# Altium schematic sheet SelfDrivingCar_SCH_STM32F103C8T6.SchDoc
size A; DocumentNumber: 5; SheetNumber: 4; SheetTotal: 7
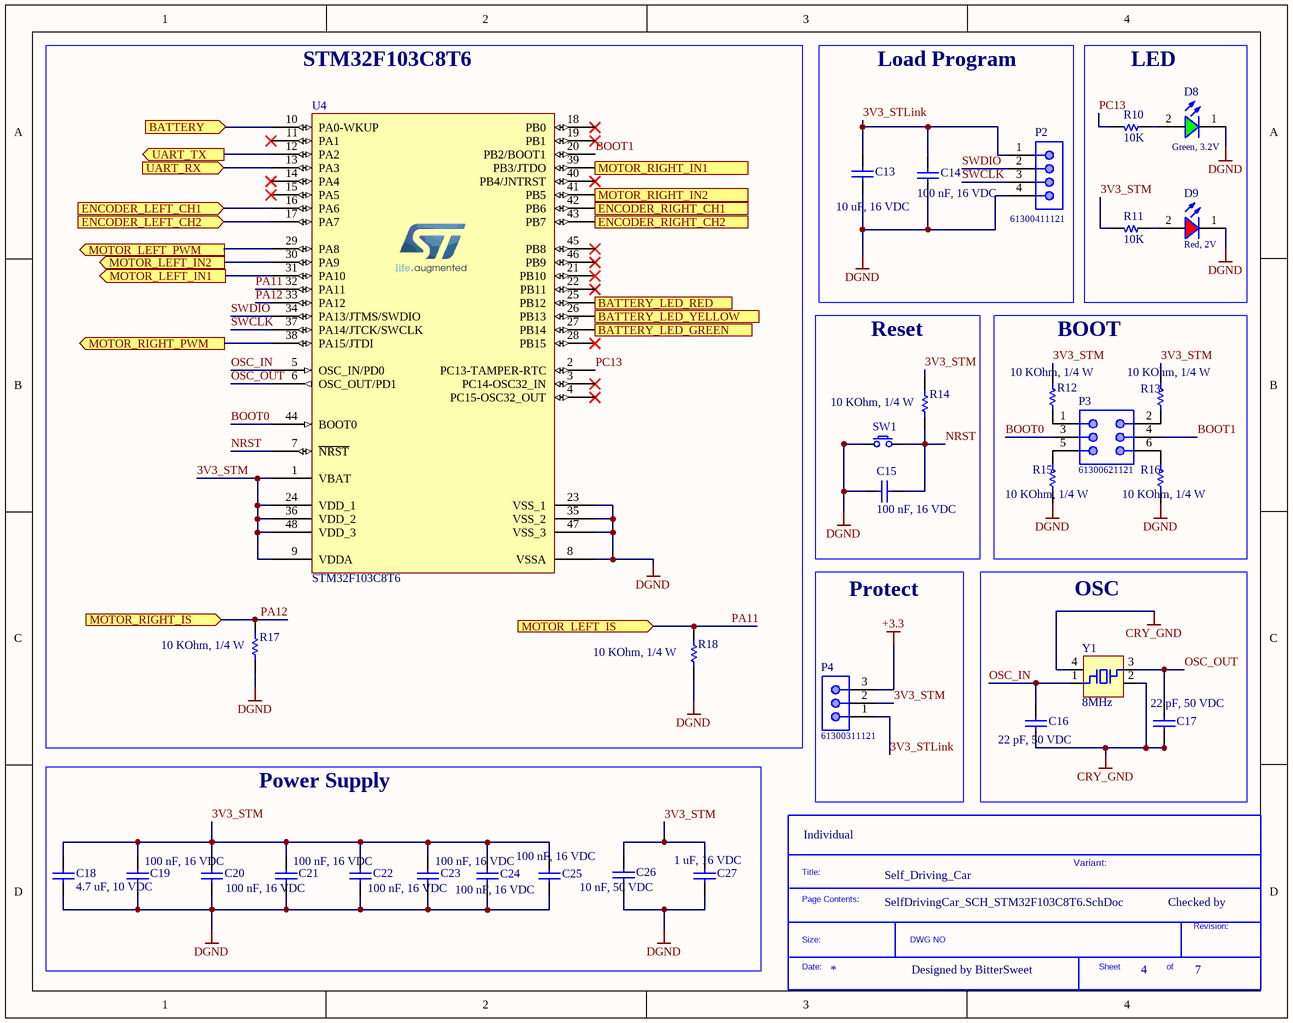
[diagram p0: SelfDrivingCar_SCH_STM32F103C8T6.SchDoc]

## Parts
*?  SDTitleBlock  (value not drawn)  (graphical)
C13  10 uF, 16 VDC  [CAP_0603]
C14  100 nF, 16 VDC  [CAP_0603]
C15  100 nF, 16 VDC  [CAP_0603]
C16  22 pF, 50 VDC  [CAP_0603]
C17  22 pF, 50 VDC  [CAP_0603]
C18  4.7 uF, 10 VDC  [CAP_0603]
C19  100 nF, 16 VDC  [CAP_0603]
C20  100 nF, 16 VDC  [CAP_0603]
C21  100 nF, 16 VDC  [CAP_0603]
C22  100 nF, 16 VDC  [CAP_0603]
C23  100 nF, 16 VDC  [CAP_0603]
C24  100 nF, 16 VDC  [CAP_0603]
C25  100 nF, 16 VDC  [CAP_0603]
C26  10 nF, 50 VDC  [CAP_0603]
C27  1 uF, 16 VDC  [CAP_0603]
D8  Green, 3.2V  [WL-SMCW_0603_H=0.7mm]
D9  Red, 2V  [WL-SMCW_0603_H=0.7mm]
P2  61300411121  [61300411121]
P3  61300621121  [61300621121]
P4  61300311121  [61300311121]
R10  10K  [R 0603]
R11  10K  [R 0603]
R12  10 KOhm, 1/4 W  [resistor_0603]
R13  10 KOhm, 1/4 W  [resistor_0603]
R14  10 KOhm, 1/4 W  [resistor_0603]
R15  10 KOhm, 1/4 W  [resistor_0603]
R16  10 KOhm, 1/4 W  [resistor_0603]
R17  10 KOhm, 1/4 W  [resistor_0603]
R18  10 KOhm, 1/4 W  [resistor_0603]
SW1  ?  [Button]  (value not drawn)
U4  STM32F103C8T6  [STM32F103C8T6]
Y1  8MHz  [Crystal SMD 4PIN 32x25]

## Blocks framed on the sheet
STM32F103C8T6: R17 R18 U4
Load Program: C13 C14 P2
LED: D8 D9 R10 R11
Reset: C15 R14 SW1
BOOT: P3 R12 R13 R15 R16
Protect: P4
OSC: C16 C17 Y1
Power Supply: C18-C27

## Ports
BATTERY (in), BATTERY_LED_GREEN (out), BATTERY_LED_RED (out), BATTERY_LED_YELLOW (out), ENCODER_LEFT_CH1 (in), ENCODER_LEFT_CH2 (in), ENCODER_RIGHT_CH1 (in), ENCODER_RIGHT_CH2 (in), MOTOR_LEFT_IN1 (out), MOTOR_LEFT_IN2 (out), MOTOR_LEFT_IS (in), MOTOR_LEFT_PWM (out), MOTOR_RIGHT_IN1 (out), MOTOR_RIGHT_IN2 (out), MOTOR_RIGHT_IS (in), MOTOR_RIGHT_PWM (out), UART_RX (in), UART_TX (out)

## Nets
+3.3: P4.3
CRY_GND: C16.1 C17.1 Y1.2(GND) Y1.4(GND)
DGND: C13.1 C14.1 C15.1 C18.1 C19.1 C20.1 C21.1 C22.1 C23.1 C24.1 C25.1 C26.1 C27.1 D8.1(K) D9.1(K) P2.4 R15.1 R16.1 R17.2 R18.1 SW1.1 U4.8(VSSA) U4.23(VSS_1) U4.35(VSS_2) U4.47(VSS_3)
3V3_STLink: C13.2 C14.2 P2.1 P4.1
3V3_STM: C18.2 C19.2 C20.2 C21.2 C22.2 C23.2 C24.2 C25.2 C26.2 C27.2 P4.2 R11.2 R12.2 R13.2 R14.2 U4.1(VBAT) U4.9(VDDA) U4.24(VDD_1) U4.36(VDD_2) U4.48(VDD_3)
BATTERY: U4.10(PA0-WKUP) ; port BATTERY
BATTERY_LED_GREEN: U4.27(PB14) ; port BATTERY_LED_GREEN
BATTERY_LED_RED: U4.25(PB12) ; port BATTERY_LED_RED
BATTERY_LED_YELLOW: U4.26(PB13) ; port BATTERY_LED_YELLOW
BOOT0: P3.3 U4.44(BOOT0)
BOOT1: P3.4 U4.20(PB2/BOOT1)
ENCODER_LEFT_CH1: U4.16(PA6) ; port ENCODER_LEFT_CH1
ENCODER_LEFT_CH2: U4.17(PA7) ; port ENCODER_LEFT_CH2
ENCODER_RIGHT_CH1: U4.42(PB6) ; port ENCODER_RIGHT_CH1
ENCODER_RIGHT_CH2: U4.43(PB7) ; port ENCODER_RIGHT_CH2
MOTOR_LEFT_IN1: U4.31(PA10) ; port MOTOR_LEFT_IN1
MOTOR_LEFT_IN2: U4.30(PA9) ; port MOTOR_LEFT_IN2
MOTOR_LEFT_PWM: U4.29(PA8) ; port MOTOR_LEFT_PWM
MOTOR_RIGHT_IN1: U4.39(PB3/JTDO) ; port MOTOR_RIGHT_IN1
MOTOR_RIGHT_IN2: U4.41(PB5) ; port MOTOR_RIGHT_IN2
MOTOR_RIGHT_PWM: U4.38(PA15/JTDI) ; port MOTOR_RIGHT_PWM
NRST: C15.2 R14.1 SW1.2 U4.7(~{NRST})
OSC_IN: C16.2 U4.5(OSC_IN/PD0) Y1.1(XTAL)
OSC_OUT: C17.2 U4.6(OSC_OUT/PD1) Y1.3(XTAL)
PA11: R18.2 U4.32(PA11) ; port MOTOR_LEFT_IS
PA12: R17.1 U4.33(PA12) ; port MOTOR_RIGHT_IS
PC13: R10.2 U4.2(PC13-TAMPER-RTC)
SWCLK: P2.3 U4.37(PA14/JTCK/SWCLK)
SWDIO: P2.2 U4.34(PA13/JTMS/SWDIO)
UART_RX: U4.13(PA3) ; port UART_RX
UART_TX: U4.12(PA2) ; port UART_TX
NetD8_2: D8.2(A) R10.1
NetD9_2: D9.2(A) R11.1
NetP3_1: P3.1 R12.1
NetP3_2: P3.2 R13.1
NetP3_5: P3.5 R15.2
NetP3_6: P3.6 R16.2

Not connected (* = marked no-connect by the designer): U4 3(PC14-OSC32_IN)* 4(PC15-OSC32_OUT)* 11(PA1)* 14(PA4)* 15(PA5)* 18(PB0)* 19(PB1)* 21(PB10)* 22(PB11)* 28(PB15)* 40(PB4/JNTRST)* 45(PB8)* 46(PB9)*

## Notes on the sheet
- (near *?) Individual
- Self_Driving_Car
- Variant:
- Checked by
- Designed by BitterSweet
- (in symbol SDTitleBlock) Title:; Page Contents:; Revision:; Size:; DWG NO; Date:; Sheet; of

## Library data of the parts
C13 = 0106031061010: CAP, size 0603, 10 uF, 16 VDC; Manufacture Name: Samsung Electro-Mechanics; Manufacture SN: CL10A106KP8NNWC; Capacitance: 10 uF; Tolerance: +/-10%; Voltage Rating DC: 16 VDC; ComponentLink2Description: Datasheet; ComponentLink2URL: https://www.mouser.vn/datasheet/2/585/MLCC-1837944.pdf; Operating Temperature: -55 to +125degC; Packaging: Tape and Reel; Mounting Technology: SMT; Size: 0603; Supplier 1 Name: Mouser; Supplier 1 SN: 187-CL10A106KP8NNWC; Supplier 1 URL: https://www.mouser.vn/ProductDetail/Samsung-Electro-Mechanics/CL10A106KP8NNWC?qs=xZ%2FP%252Ba9zWqZx8LSX23YqWA%3D%3D&utm_source=mouser-refine-download&utm_medium=file&utm_campaign=CL10A106KP8NNWC&utm_content=Samsung-Electro-Mechanics; Supplier 2 Name: Digi-Key; Supplier 2 SN: 1276-CL10A106KP8NNWCTR-ND; Supplier 2 URL: https://www.digikey.com/en/products/detail/samsung-electro-mechanics/cl10a106kp8nnwc/16572907; Supplier 3 Name: thegioiic; Supplier 3 SN: N/A; Supplier 3 URL: https://www.thegioiic.com/tu-gom-0603-10uf-16v; Value: 10 uF, 16 VDC; SUPPLIER NAME: JLCPCB; SUPPLIER SN: C703132; SUPPLIER URL: https://jlcpcb.com/partdetail/738561-GRM188R61C106MAALD/C703132
C14 C15 C19-C25 = 0106031041050: CAP, size 0603, 100 nF, 16 VDC; Manufacture Name: TDK; Manufacture SN: CGA3E3X8R1H104K080AE; Capacitance: 100 nF; Tolerance: +/-10%; Voltage Rating DC: 16 VDC; ComponentLink2Description: Datasheet; ComponentLink2URL: https://product.tdk.com/system/files/dam/doc/product/capacitor/ceramic/mlcc/catalog/mlcc_automotive_soft_en.pdf?ref_disty=mouser; Operating Temperature: -55 to +125degC; Packaging: Tape and Reel; Mounting Technology: SMT; Size: 0603; Supplier 1 Name: Mouser; Supplier 1 SN: 810-CGA3E3X8R1H104KA; Supplier 1 URL: https://www.mouser.com/ProductDetail/TDK/CGA3E3X8R1H104K080AE?qs=nQSIdc08i%252Bd8g3IRRgU2bw%3D%3D&utm_source=mouser-refine-download&utm_medium=file&utm_campaign=CGA3E3X8R1H104K080AE&utm_content=TDK; Supplier 2 Name: Digi-Key; Supplier 2 SN: 445-173697-2-ND; Supplier 2 URL: https://www.digikey.com/en/products/detail/tdk-corporation/cga3e3x8r1h104k080ae/5809262; Supplier 3 Name: thegioiic; Supplier 3 SN: N/A; Supplier 3 URL: https://www.thegioiic.com/tu-gom-0603-100nf-0-1uf-16v; Value: 100 nF, 16 VDC; SUPPLIER NAME: JLCPCB; SUPPLIER SN: C525499; SUPPLIER URL: https://jlcpcb.com/partdetail/Walsin_TechCorp-0603B104J160CT/C525499
C16 C17 = 0106032200550: CAP, size 0603, 22 pF, 50 VDC; Manufacture Name: TDK; Manufacture SN: CGA3E2NP01H220J080AA; Capacitance: 22 pF; Tolerance: +/-5%; Voltage Rating DC: 50 VDC; ComponentLink2Description: Datasheet; ComponentLink2URL: https://product.tdk.com/system/files/dam/doc/product/capacitor/ceramic/mlcc/catalog/mlcc_automotive_hightemp_en.pdf?ref_disty=mouser; Operating Temperature: -55 to +125degC; Packaging: Tape and Reel; Mounting Technology: SMT; Size: 0603; Supplier 1 Name: Mouser; Supplier 1 SN: 810-CGA3E2NP01H220JA; Supplier 1 URL: https://www.mouser.com/ProductDetail/TDK/CGA3E2NP01H220J080AA?qs=xLDY6iXSiQbIDiPJq57tVA%3D%3D&utm_source=mouser-refine-download&utm_medium=file&utm_campaign=CGA3E2NP01H220J080AA&utm_content=TDK; Supplier 2 Name: Digi-Key; Supplier 2 SN: 445-12401-2-ND; Supplier 2 URL: https://www.digikey.com/en/products/detail/tdk-corporation/cga3e2np01h220j080aa/3949637; Supplier 3 Name: thegioiic; Supplier 3 SN: N/A; Supplier 3 URL: https://www.thegioiic.com/tu-gom-0603-22pf-50v; Value: 22 pF, 50 VDC; SUPPLIER NAME: JLCPCB; SUPPLIER SN: C388039; SUPPLIER URL: https://jlcpcb.com/partdetail/Walsin_TechCorp-0603N220G500CT/C388039
C18 = 0106034751010: CAP, size 0603, 4.7 uF, 10 VDC; Manufacture Name: Samsung Electro-Mechanics; Manufacture SN: CL10A475KP8NNWC; Capacitance: 4.7 uF; Tolerance: +/-10%; Voltage Rating DC: 10 VDC; ComponentLink2Description: Datasheet; ComponentLink2URL: https://www.mouser.vn/datasheet/2/585/Samsung_MLCC_1837944-1929650.pdf; Operating Temperature: -55 to +125degC; Packaging: Tape and Reel; Mounting Technology: SMT; Size: 0603; Supplier 1 Name: Mouser; Supplier 1 SN: 187-CL10A475KP8NNWC; Supplier 1 URL: https://www.mouser.vn/ProductDetail/Samsung-Electro-Mechanics/CL10A475KP8NNWC?qs=81r%252BiQLm7BQyXBb52PEUBA%3D%3D&utm_source=mouser-refine-download&utm_medium=file&utm_campaign=CL10A475KP8NNWC&utm_content=Samsung-Electro-Mechanics; Supplier 2 Name: Digi-Key; Supplier 2 SN: 1276-CL10A475KP8NNWCTR-ND; Supplier 2 URL: https://www.digikey.com/en/products/detail/samsung-electro-mechanics/cl10a475kp8nnwc/16572736; Supplier 3 Name: thegioiic; Supplier 3 SN: N/A; Supplier 3 URL: https://www.thegioiic.com/tu-gom-0603-4-7uf-25v; Value: 4.7 uF, 10 VDC; SUPPLIER NAME: JLCPCB; SUPPLIER SN: C961503; SUPPLIER URL: https://jlcpcb.com/partdetail/1041342-C0603B475K010T/C961503
C26 = 0106031031050: CAP, size 0603, 10 nF, 50 VDC; Manufacture Name: TDK; Manufacture SN: CGA3E2X8R1H103K080AA; Capacitance: 10 nF; Tolerance: +/-10%; Voltage Rating DC: 50 VDC; ComponentLink2Description: Datasheet; ComponentLink2URL: https://product.tdk.com/system/files/dam/doc/product/capacitor/ceramic/mlcc/catalog/mlcc_automotive_hightemp_en.pdf?ref_disty=mouser; Operating Temperature: -55 to +125degC; Packaging: Tape and Reel; Mounting Technology: SMT; Size: 0603; Supplier 1 Name: Mouser; Supplier 1 SN: 810-CGA3E2X8R1H103K; Supplier 1 URL: https://www.mouser.com/ProductDetail/TDK/CGA3E2X8R1H103K080AA?qs=NRhsANhppD89WrzFr8uamw%3D%3D&utm_source=mouser-refine-download&utm_medium=file&utm_campaign=CGA3E2X8R1H103K080AA&utm_content=TDK; Supplier 2 Name: Digi-Key; Supplier 2 SN: 445-5892-2-ND; Supplier 2 URL: https://www.digikey.com/en/products/detail/tdk-corporation/cga3e2x8r1h103k080aa/2443370; Supplier 3 Name: thegioiic; Supplier 3 SN: N/A; Supplier 3 URL: N/Ahttps://www.thegioiic.com/tu-gom-0603-10nf-50v; Value: 10 nF, 50 VDC; SUPPLIER NAME: JLCPCB; SUPPLIER SN: C513325; SUPPLIER URL: https://jlcpcb.com/partdetail/-06035C103K4T2A/C513325
C27 = 0106031051016: CAP, size 0603, 1 uF, 16 VDC; Manufacture Name: Samsung Electro-Mechanics; Manufacture SN: CL10B105KO8NNWC; Capacitance: 1 uF; Tolerance: +/-10%; Voltage Rating DC: 16 VDC; ComponentLink2Description: Datasheet; ComponentLink2URL: https://www.mouser.vn/datasheet/2/585/Samsung_MLCC_1837944-1929650.pdf; Operating Temperature: -55 to +125degC; Packaging: Tape and Reel; Mounting Technology: SMT; Size: 0603; Supplier 1 Name: Mouser; Supplier 1 SN: 187-CL10B105KO8NNWC; Supplier 1 URL: https://www.mouser.vn/ProductDetail/Samsung-Electro-Mechanics/CL10B105KO8NNWC?qs=81r%252BiQLm7BT%252BXtc72qn1ug%3D%3D&utm_source=mouser-refine-download&utm_medium=file&utm_campaign=CL10B105KO8NNWC&utm_content=Samsung-Electro-Mechanics; Supplier 2 Name: Digi-Key; Supplier 2 SN: 1276-CL10B105KO8NNWCTR-ND; Supplier 2 URL: https://www.digikey.com/en/products/detail/samsung-electro-mechanics/cl10b105ko8nnwc/16572783; Supplier 3 Name: thegioiic; Supplier 3 SN: N/A; Supplier 3 URL: https://www.thegioiic.com/tu-gom-0603-1uf-16v; Value: 1 uF, 16 VDC; SUPPLIER NAME: JLCPCB; SUPPLIER SN: C76706; SUPPLIER URL: https://jlcpcb.com/partdetail/Tdk-CGA3E1X7R1C105KT0Y0N/C76706
D8 = 160603GreenClear: WL-SMCW SMT Mono-color Chip LED Waterclear, size 0603, Green, 3.2V, 140deg; Type: Clear; Color: Green; Size: 0603; ComponentLink1Description: Datasheet link; ComponentLink1URL: N/A; ComponentLink2Description: Supplier 1 URL; ComponentLink2URL: https://www.mouser.vn/ProductDetail/Wurth-Elektronik/150060GS75000?qs=LlUlMxKIyB0UYkq5lDO8nA%3D%3D; ComponentLink3Description: Supplier 2 URL; ComponentLink3URL: https://www.digikey.com/en/products/detail/liteon/LTST-C191KGKT/386835; ComponentLink4Description: Supplier 3 URL; ComponentLink4URL: https://www.thegioiic.com/led-xanh-la-0603-dan-smd-trong-suot; Supplier 1 Name: Mouser; Supplier 1 SN: 710-150060GS75000; Supplier 1 URL: https://www.mouser.vn/ProductDetail/Wurth-Elektronik/150060GS75000?qs=LlUlMxKIyB0UYkq5lDO8nA%3D%3D; Supplier 2 Name: Digi-Key; Supplier 2 SN: 160-1446-2-ND; Supplier 2 URL: https://www.digikey.com/en/products/detail/liteon/LTST-C191KGKT/386835; Supplier 3 Name: ICDayRoi; Supplier 3 SN: N/A; Supplier 3 URL: https://www.thegioiic.com/led-xanh-la-0603-dan-smd-trong-suot; Value: Green, 3.2V; SUPPLIER NAME: JLCPCB; SUPPLIER SN: *; SUPPLIER URL: *
D9 = 160603RedClear: WL-SMCW SMT Mono-color Chip LED Waterclear, size 0603, Red, 2V, 140deg; Type: Clear; Color: Red; Size: 0603; ComponentLink1Description: Datasheet link; ComponentLink1URL: N/A; ComponentLink2Description: Supplier 1 URL; ComponentLink2URL: https://www.mouser.vn/ProductDetail/Wurth-Elektronik/150060RS75000?qs=LlUlMxKIyB3QnmZ3fw%2FVCA%3D%3D; ComponentLink3Description: Supplier 2 URL; ComponentLink3URL: https://www.digikey.com/en/products/detail/liteon/LTST-C191KRKT/386837; ComponentLink4Description: Supplier 3 URL; ComponentLink4URL: https://www.thegioiic.com/led-do-0603-dan-smd-trong-suot; Supplier 1 Name: Mouser; Supplier 1 SN: 710-150060RS75000; Supplier 1 URL: https://www.mouser.vn/ProductDetail/Wurth-Elektronik/150060RS75000?qs=LlUlMxKIyB3QnmZ3fw%2FVCA%3D%3D; Supplier 2 Name: Digi-Key; Supplier 2 SN: 160-1447-2-ND; Supplier 2 URL: https://www.digikey.com/en/products/detail/liteon/LTST-C191KRKT/386837; Supplier 3 Name: ICDayRoi; Supplier 3 SN: N/A; Supplier 3 URL: https://www.thegioiic.com/led-do-0603-dan-smd-trong-suot; Value: Red, 2V; SUPPLIER NAME: JLCPCB; SUPPLIER SN: *; SUPPLIER URL: *
P2 = 61300411121: WR-PHD Pin Header, THT, pitch 2.54mm, Single Row, Vertical, 4p; Manufacturer: Wurth Elektronik; Pin Number: 4; Rated Current: 3A; Working Voltage: 250VAC; Withstanding Voltage: 500VAC; Contact Resistance: 20mOhm; Supply Name 1: Mouser; ComponentLink1Description: Manufacturer; ComponentLink1URL: http://www.we-online.de; ComponentLink2Description: Datasheet; ComponentLink2URL: https://www.we-online.com/catalog/datasheet/61300411121.pdf; Manufacturer Part Number: 61300411121; Published Date: May 2020; Pitch: 2.54mm; Operating Temperature: -40 to +105degC; Mounting Technology: THT; Packaging: Bag; Gender: Pin Header; Row Number: Single; Orientation: Vertical; ComponentLink3Description: Global Supply; ComponentLink3URL: https://www.we-online.com/en/components/products/PHD_2_54_THT_PIN_HEADER_6130XX11121?sq=61300411121#61300411121; ComponentLink4Description: Global Supply; ComponentLink4URL: https://www.mouser.vn/ProductDetail/Wurth-Elektronik/61300411121?qs=PhR8RmCirEYQcLLqXD8rAA%3D%3D; Supplier 1 Name: Mouser; Supplier 1 SN: 710-61300311121; Supplier 1 URL: https://www.mouser.vn/ProductDetail/Wurth-Elektronik/61300311121?qs=PhR8RmCirEYxRWFJzNKsUw%3D%3D; Supplier 2 Name: Digi-Key; Supplier 2 SN: N/A; Supplier 2 URL: N/A; Supplier 3 Name: thegioiic; Supplier 3 SN: N/A; Supplier 3 URL: N/A; SUPPLIER NAME: JLCPCB; SUPPLIER SN: *; SUPPLIER URL: *
P3 = 61300621121: WR-PHD Pin Header, THT, pitch 2.54mm, Dual Row, Vertical, 6p; Manufacturer: Wurth Elektronik; Pin Number: 6; Rated Current: 3A; Working Voltage: 250VAC; Withstanding Voltage: 500VAC; Contact Resistance: 20mOhm; Supply name 1: Mouser; ComponentLink1Description: Manufacturer; ComponentLink1URL: http://www.we-online.de; ComponentLink2Description: Datasheet; ComponentLink2URL: https://www.we-online.com/catalog/datasheet/61300621121.pdf; Manufacturer Part Number: 61300621121; Published Date: May 2020; Pitch: 2.54mm; Operating Temperature: -40 to +105degC; Mounting Technology: THT; Packaging: Bag; Gender: Pin Header; Row Number: Dual; Orientation: Vertical; ComponentLink3Description: Global Supply; ComponentLink3URL: https://www.we-online.com/en/components/products/PHD_2_54_THT_DUAL_PIN_HEADER_6130XX21121?sq=61300621121#61300621121; ComponentLink4Description: Global Supply; ComponentLink4URL: https://www.mouser.vn/ProductDetail/Wurth-Elektronik/61300621121?qs=PhR8RmCirEb94hrEcn0AQg%3D%3D; Supplier 1 Name: Mouser; Supplier 1 SN: 710-61300621121; Supplier 1 URL: https://www.mouser.vn/ProductDetail/Wurth-Elektronik/61300621121?qs=PhR8RmCirEb94hrEcn0AQg%3D%3D; Supplier 2 Name: Digi-Key; Supplier 2 SN: N/A; Supplier 2 URL: N/A; Supplier 3 Name: thegioiic; Supplier 3 SN: N/A; Supplier 3 URL: N/A; SUPPLIER NAME: JLCPCB; SUPPLIER SN: *; SUPPLIER URL: *
P4 = 61300311121: WR-PHD Pin Header, THT, pitch 2.54mm, Single Row, Vertical, 3p; Manufacturer: Wurth Elektronik; Pin Number: 3; Rated Current: 3A; Working Voltage: 250VAC; Withstanding Voltage: 500VAC; Contact Resistance: 20mOhm; Supply Name 1: Mouser; ComponentLink1Description: Manufacturer; ComponentLink1URL: http://www.we-online.de; ComponentLink2Description: Datasheet; ComponentLink2URL: https://www.we-online.com/catalog/datasheet/61300311121.pdf; Manufacturer Part Number: 61300311121; Published Date: May 2020; Pitch: 2.54mm; Operating Temperature: -40 to +105degC; Mounting Technology: THT; Packaging: Bag; Gender: Pin Header; Row Number: Single; Orientation: Vertical; ComponentLink3Description: Global Supply; ComponentLink3URL: https://www.mouser.vn/ProductDetail/Wurth-Elektronik/61300311121?qs=PhR8RmCirEYxRWFJzNKsUw%3D%3D; Supplier 1 Name: Mouser; Supplier 1 SN: 710-61300311121; Supplier 1 URL: https://www.mouser.vn/ProductDetail/Wurth-Elektronik/61300311121?qs=PhR8RmCirEYxRWFJzNKsUw%3D%3D; Supplier 2 Name: Digi-Key; Supplier 2 SN: N/A; Supplier 2 URL: N/A; Supplier 3 Name: thegioiic; Supplier 3 SN: N/A; Supplier 3 URL: N/A; SUPPLIER NAME: JLCPCB; SUPPLIER SN: *; SUPPLIER URL: *
R10 R11 = Resistor: ComponentLink1Description: URL; ComponentLink1URL: https://www.thegioiic.com/dien-tro-10-kohm-0603-1-; SUPPLIER NAME: JLCPCB; SUPPLIER SN: C2989345; SUPPLIER URL: https://jlcpcb.com/partdetail/3448768-TC0325D1002T5F/C2989345
R12-R18 = 0006031031: RES, size 0603, 10 KOhm, 1/4 W; Manufacture  Name: OEM; Resistance: 10 KOhm; Rated Power: 1/4 W; Resistance Tolerance: +/-1%; Size: 0603; Mounting Technology: SMT; Supplier 1 Name: Mouser; Supplier 1 SN: 755-ESR03EZPF1002; Supplier 2 Name: Digi-Key; Supplier 2 SN: RHM10KADTR-ND RHM10KADCT-ND RHM10KADDKR-ND; Supplier 1 URL: https://www.mouser.vn/ProductDetail/ROHM-Semiconductor/ESR03EZPF1002?qs=sGAEpiMZZMvdGkrng054t67Efho1F8r6CDeAsqwFse8%3D; Supplier 3 Name: thegioiic; Supplier 3 SN: N/A; Manufacture  SN: OEM; Value: 10 KOhm, 1/4 W; ComponentLink1Description: Datasheet link; ComponentLink1URL: https://fscdn.rohm.com/en/products/databook/datasheet/passive/resistor/chip_resistor/esr-e.pdf; ComponentLink2Description: Supplier 1 URL; ComponentLink2URL: N/A; ComponentLink3Description: Supplier 2 URL; ComponentLink3URL: https://www.digikey.com/en/products/detail/rohm-semiconductor/ESR03EZPF1002/1983429; ComponentLink4Description: Supplier 3 URL; ComponentLink4URL: N/A; Supplier 2 URL: https://www.digikey.com/en/products/detail/rohm-semiconductor/ESR03EZPF1002/1983429; SUPPLIER NAME: JLCPCB; SUPPLIER SN: C2989345; SUPPLIER URL: https://jlcpcb.com/partdetail/3448768-TC0325D1002T5F/C2989345
  R12-R16: Supplier 3 URL: https://www.thegioiic.com/dien-tro-10-kohm-0603-1-
  R17 R18: Supplier 3 URL: N/A
SW1 = Button Tactile 3x4x2.5mm: Button Tafctile 3x4x2.5 mm. 2 pin SMD; ComponentLink1Description: URL; ComponentLink1URL: https://www.thegioiic.com/nut-nhan-3x4mm-cao-2-5mm-2-chan-smd; SUPPLIER NAME: JLCPCB; SUPPLIER SN: *
U4 = STM32F103C8T6: ARM Microcontrollers - MCU 32BIT Cortex M3 64KB 20KB RAM 2X12 ADC; Manufacturer: STM; Manufacture SN: STM32F103C8T6TR; Pad count: 48; ComponentLink1Description: Datasheet; Part Number: STM32F103C8T6; Value: STM32F103C8T6; ComponentLink1URL: https://www.mouser.com/datasheet/2/389/stm32f103c8-1851025.pdf; Footprint name: LQFP48; ComponentLink2Description: Supplier 1 URL; ComponentLink2URL: https://www.mouser.com/ProductDetail/STMicroelectronics/STM32F103C8T6?qs=bhCVus9SdFtq6kqxsU5%2FDA%3D%3D; ComponentLink3Description: Supplier 2 URL; ComponentLink3URL: 497-17666-2-ND; ComponentLink4Description: Supplier 3 URL; ComponentLink4URL: https://www.thegioiic.com/stm32f103c8t6-32-bit-arm-cortex-m3-microcontroller-72mhz-64kb-flash-48-lqfp; Supplier 1 Name: Mouser; Supplier 1 SN: 511-STM32F103C8T6; Supplier 1 URL: https://www.mouser.com/ProductDetail/STMicroelectronics/STM32F103C8T6?qs=bhCVus9SdFtq6kqxsU5%2FDA%3D%3D; Supplier 2 Name: Digi-Key; Supplier 2 SN: 497-17666-2-ND; Supplier 2 URL: https://www.digikey.com/en/products/detail/stmicroelectronics/stm32f103c8t6tr/2122442; Supplier 3 Name: thegioiic; Supplier 3 SN: STM32F103C8T6; Supplier 3 URL: https://www.thegioiic.com/stm32f103c8t6-32-bit-arm-cortex-m3-microcontroller-72mhz-64kb-flash-48-lqfp; SUPPLIER NAME: JLCPCB; SUPPLIER SN: C8734; SUPPLIER URL: https://jlcpcb.com/partdetail/Stmicroelectronics-STM32F103C8T6/C8734
Y1 = Crystal 4pin: ComponentLink1Description: URL; ComponentLink1URL: https://www.thegioiic.com/thach-anh-8mhz-3225-4-chan-smd; SUPPLIER NAME: JLCPCB; SUPPLIER SN: C518156; SUPPLIER URL: https://jlcpcb.com/partdetail/534693-3225_8_00_20_10_10A/C518156